# Altium schematic sheet PGA.SchDoc
size A4
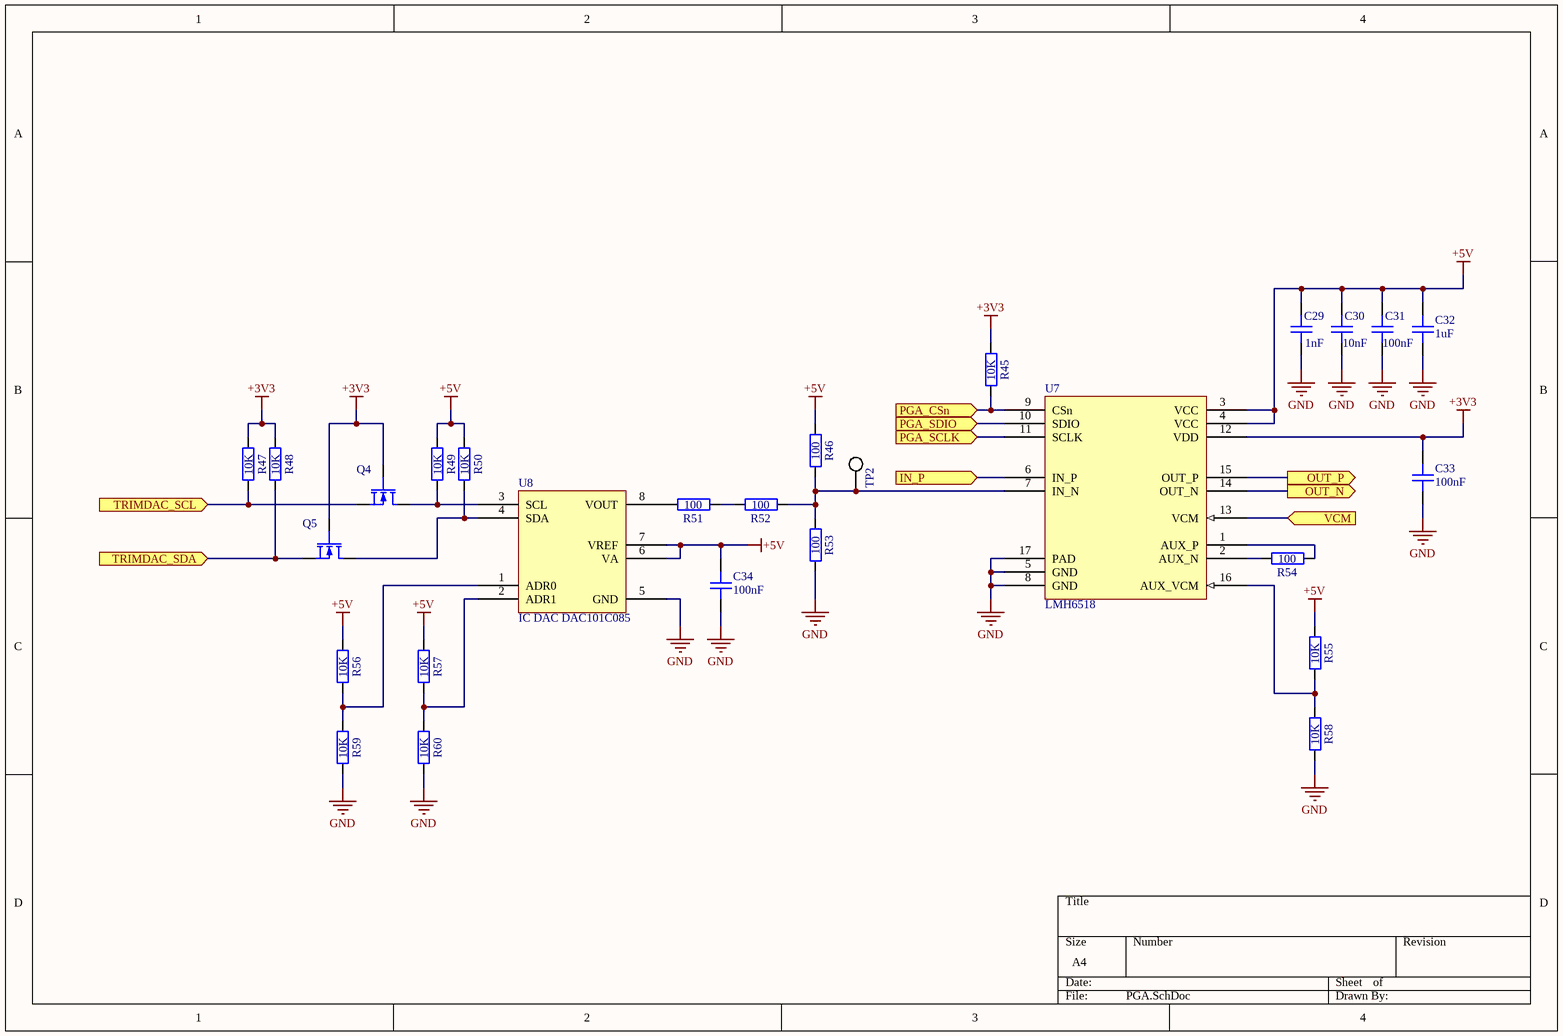
[diagram p0: PGA.SchDoc]

## Parts
C29  value 1nF  [GEN_C_0402]  (hidden comment: CAP 1nF 50V X7R 0402)
C30  value 10nF  [GEN_C_0402]  (hidden comment: CAP 10nF 50V X7R 0402)
C31  value 100nF  [GEN_C_0402]  (hidden comment: CAP 100nF 16V X7R 0402)
C32  value 1uF  [GEN_C_0402]  (hidden comment: CAP 1uF 25V X5R 0402)
C33  value 100nF  [GEN_C_0402]  (hidden comment: CAP 100nF 16V X7R 0402)
C34  value 100nF  [GEN_C_0402]  (hidden comment: CAP 100nF 16V X7R 0402)
Q4  NMOS DMN62D0UW  [GEN_SOT_323]  (value not drawn)
Q5  NMOS DMN62D0UW  [GEN_SOT_323]  (value not drawn)
R45  value 10K  [GEN_R_0402]  (hidden comment: RES 10K OHM 1% 1/10W 0402)
R46  value 100  [GEN_R_0402]  (hidden comment: RES 100 OHM 1% 1/10W 0402)
R47  value 10K  [GEN_R_0402]  (hidden comment: RES 10K OHM 1% 1/10W 0402)
R48  value 10K  [GEN_R_0402]  (hidden comment: RES 10K OHM 1% 1/10W 0402)
R49  value 10K  [GEN_R_0402]  (hidden comment: RES 10K OHM 1% 1/10W 0402)
R50  value 10K  [GEN_R_0402]  (hidden comment: RES 10K OHM 1% 1/10W 0402)
R51  value 100  [GEN_R_0402]  (hidden comment: RES 100 OHM 1% 1/10W 0402)
R52  value 100  [GEN_R_0402]  (hidden comment: RES 100 OHM 1% 1/10W 0402)
R53  value 100  [GEN_R_0402]  (hidden comment: RES 100 OHM 1% 1/10W 0402)
R54  value 100  [GEN_R_0402]  (hidden comment: RES 100 OHM 1% 1/10W 0402)
R55  value 10K  [GEN_R_0402]  (hidden comment: RES 10K OHM 1% 1/10W 0402)
R56  value 10K  [GEN_R_0402]  (hidden comment: RES 10K OHM 1% 1/10W 0402)
R57  value 10K  [GEN_R_0402]  (hidden comment: RES 10K OHM 1% 1/10W 0402)
R58  value 10K  [GEN_R_0402]  (hidden comment: RES 10K OHM 1% 1/10W 0402)
R59  value 10K  [GEN_R_0402]  (hidden comment: RES 10K OHM 1% 1/10W 0402)
R60  value 10K  [GEN_R_0402]  (hidden comment: RES 10K OHM 1% 1/10W 0402)
TP2  5019  [KEY_5019]  (value not drawn)
U7  LMH6518  [TI_WQFN_RGH0016A]
U8  IC DAC DAC101C085  [TI_VSSOP8_DGK]

## Ports
IN_P (in), OUT_N (out), OUT_P (out), PGA_CSn (in), PGA_SCLK (in), PGA_SDIO (in), TRIMDAC_SCL (in), TRIMDAC_SDA (in), VCM (in)

## Nets
+3V3: C33.2 Q4.2(G) Q5.2(G) R45.2 R47.2 R48.2 U7.12(VDD)
+5V: C29.2 C30.2 C31.2 C32.2 C34.2 R46.2 R49.2 R50.2 R55.2 R56.2 R57.2 U7.3(VCC) U7.4(VCC) U8.6(VA) U8.7(VREF)
GND: C29.1 C30.1 C31.1 C32.1 C33.1 C34.1 R53.1 R58.1 R59.1 R60.1 U7.5(GND) U7.8(GND) U7.17(PAD) U8.5(GND)
IN_P: U7.6(IN_P) ; port IN_P
OUT_N: U7.14(OUT_N) ; port OUT_N
OUT_P: U7.15(OUT_P) ; port OUT_P
PGA_CSn: R45.1 U7.9(CSn) ; port PGA_CSn
PGA_SCLK: U7.11(SCLK) ; port PGA_SCLK
PGA_SDIO: U7.10(SDIO) ; port PGA_SDIO
TRIMDAC_SCL: Q4.3(S) R47.1 ; port TRIMDAC_SCL
TRIMDAC_SDA: Q5.3(S) R48.1 ; port TRIMDAC_SDA
VCM: U7.13(VCM) ; port VCM
NetQ4_1: Q4.1(D) R49.1 U8.3(SCL)
NetQ5_1: Q5.1(D) R50.1 U8.4(SDA)
NetR46_1: R46.1 R52.1 R53.2 TP2.1 U7.7(IN_N)
NetR51_1: R51.1 R52.2
NetR51_2: R51.2 U8.8(VOUT)
NetR54_1: R54.1 U7.1(AUX_P)
NetR54_2: R54.2 U7.2(AUX_N)
NetR55_1: R55.1 R58.2 U7.16(AUX_VCM)
NetR56_1: R56.1 R59.2 U8.1(ADR0)
NetR57_1: R57.1 R60.2 U8.2(ADR1)

## Library data of the parts
Q4 Q5 = NMOS DMN62D0UW: Vdss: 60V; Id: 340mA; Max Power: 320mW; Supplier 1: Digi-Key; Supplier Part Number 1: DMN62D0UW-7DICT-ND
R45 R47-R50 R55-R60 = RES 10K OHM 1% 1/10W 0402: Power Rating: 0.1W; Tolerance: 1%; Package: 0402; Supplier 1: Digi-Key; Supplier Part Number 1: P10.0KLCT-ND
R46 R51-R54 = RES 100 OHM 1% 1/10W 0402: Power Rating: 0.1W; Tolerance: 1%; Package: 0402; Supplier 1: Digi-Key; Supplier Part Number 1: P100LCT-ND
TP2 = TP KEYSTONE 5019: Supplier 1: Digi-Key; Supplier Part Number 1: 36-5019CT-ND
U7 = IC PGA LMH6518: Supplier 1: Digi-Key; Supplier Part Number 1: LMH6518SQE/NOPBCT-ND
C29 = CAP 1nF 50V X7R 0402: Package: 0402; Voltage Rating: 50V; Supplier 1: Digi-Key; Supplier Part Number 1: 490-4761-1-ND
C30 = CAP 10nF 50V X7R 0402: Package: 0402; Voltage Rating: 50V; Supplier 1: Digi-Key; Supplier Part Number 1: 490-4762-1-ND
C31 C33 C34 = CAP 100nF 16V X7R 0402: Package: 0402; Voltage Rating: 16V; Supplier 1: Digi-Key; Supplier Part Number 1: 490-4759-1-ND
C32 = CAP 1uF 25V X5R 0402: Package: 0402; Voltage Rating: 25V; Supplier 1: Digi-Key; Supplier Part Number 1: 490-10017-1-ND
U8 = IC DAC DAC101C085: Supplier 1: Digi-Key; Supplier Part Number 1: DAC101C085CIMM/NOPBCT-ND